# EAGLE design BLEbee-2_0_0-REV-A (EAGLE 6.4)
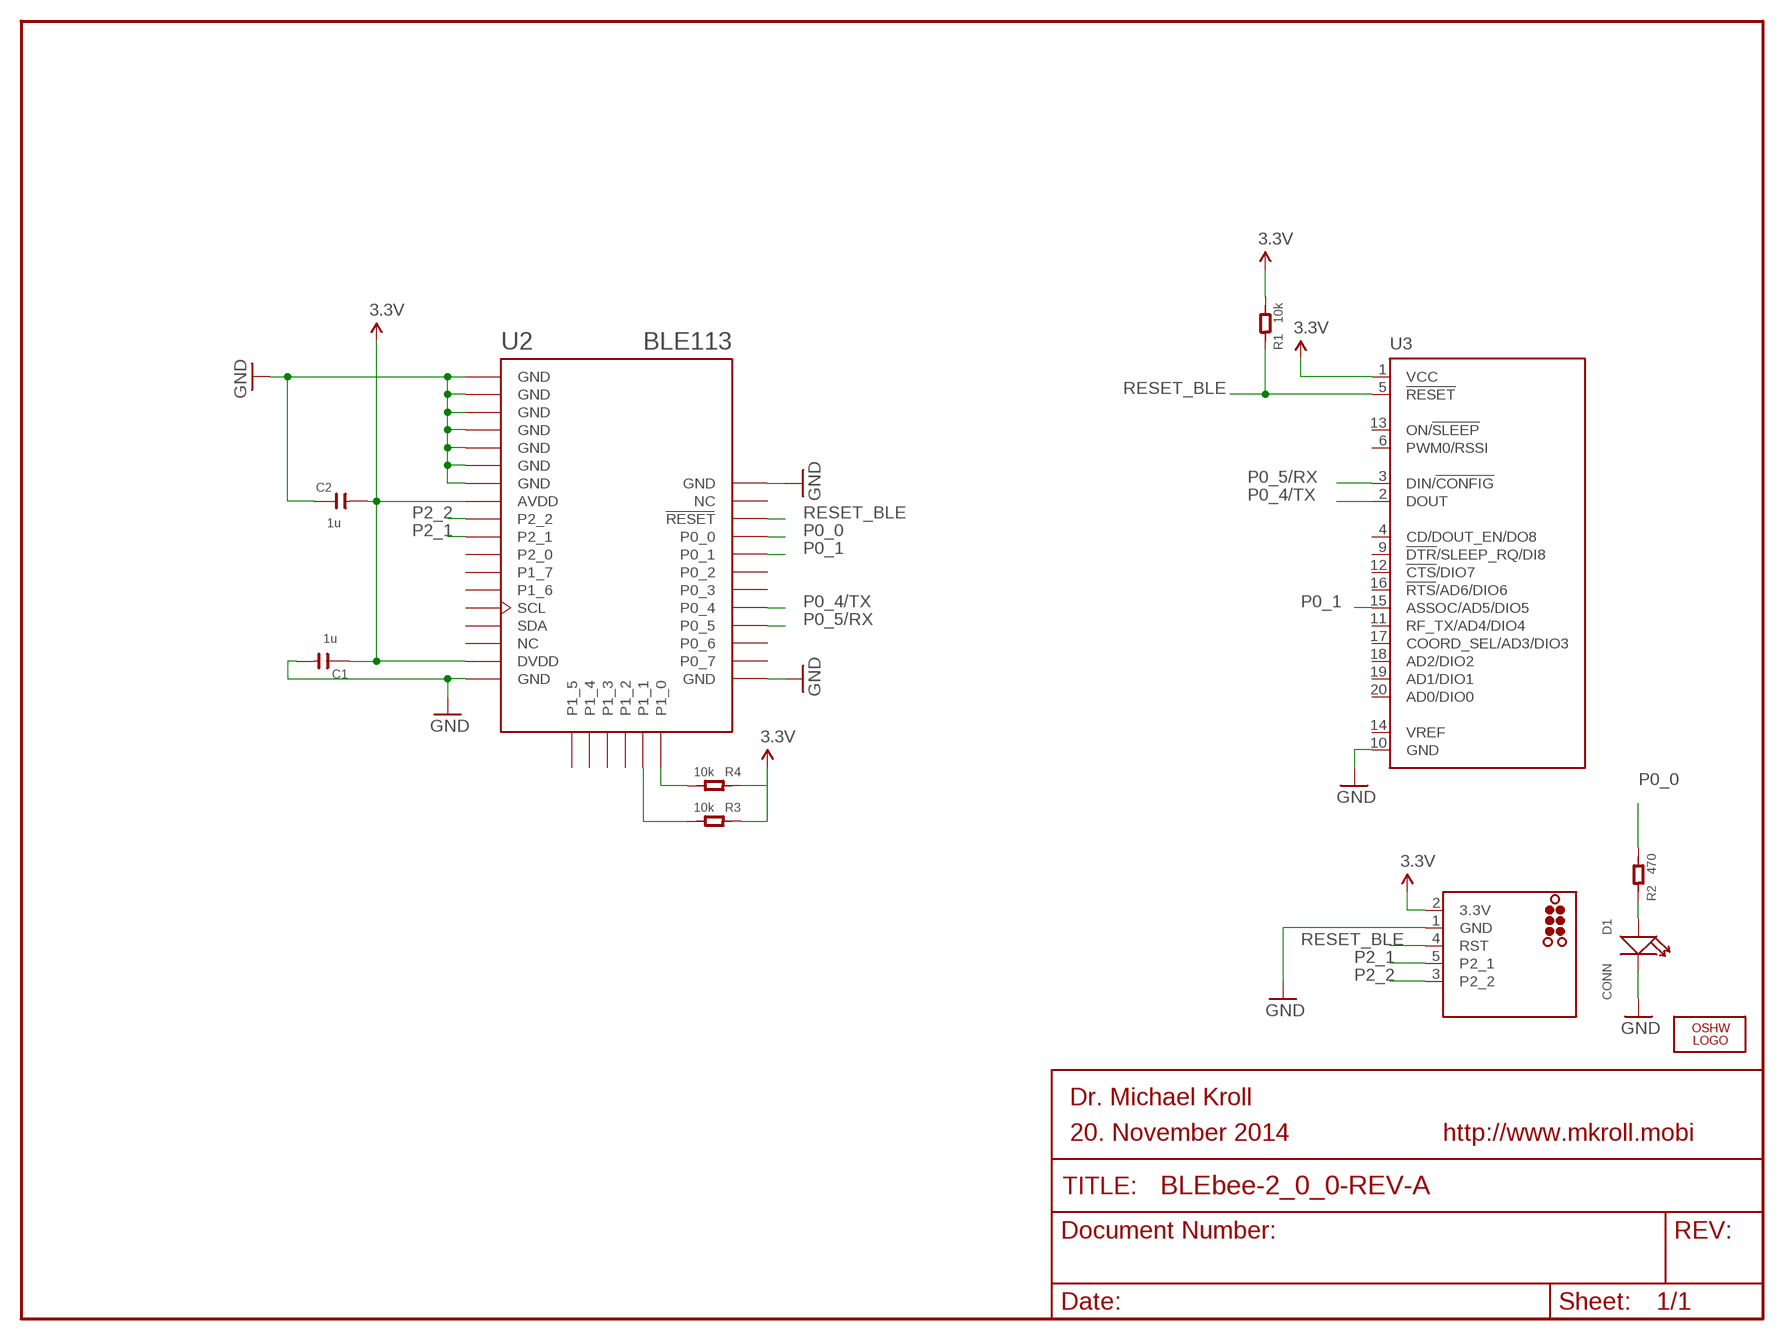
[diagram p0: schematic, sheet 1]

## Parts
C1  1u  C-0603  [C0603]
C2  1u  C-0603  [C0603]
D1  CONN  LED  [LED0603]
J1  TC2030-CC-DEBUGGER  [TC2030-MCP-NL]
LOGO1  LOGO-OSHW-6MILX0100-NT  [OSHW_6X100_NOTEXT]
R1  10k  R-0603  [R0603]
R2  470  R-0603  [R0603]
R3  10k  R-0603  [R0603]
R4  10k  R-0603  [R0603]
U2  BLE113  BLE113-A-VISUAL  [BLE113-A]
U3  MODULE_BEE-XBEE-DIP  [MODULE_20P-DIP-2.0-W/-SILK]

## Nets
3.3V: C1.2 C2.1 J1.2(3.3V) R1.2 R3.1 R4.1 U2.AVDD U2.DVDD U3.1(VCC)
GND: C1.1 C2.2 D1.- J1.1(GND) U2.GND U2.GND@2(GND) U2.GND@3(GND) U2.GND@4(GND) U2.GND@5(GND) U2.GND@6(GND) U2.GND@7(GND) U2.GND@8(GND) U2.GND@9(GND) U2.GND@10(GND) U3.10(GND)
N$1: D1.+ R2.1
N$12: R4.2 U2.P1_0
N$13: R3.2 U2.P1_1
P0_0: R2.2 U2.P0_0
P0_1: U2.P0_1 U3.15(ASSOC/AD5/DIO5)
P0_4/TX: U2.P0_4 U3.2(DOUT)
P0_5/RX: U2.P0_5 U3.3(DIN/!CONFIG)
P2_1: J1.5(P2_1) U2.P2_1
P2_2: J1.3(P2_2) U2.P2_2
RESET_BLE: J1.4(RST) R1.1 U2.RESET U3.5(!RESET)
Unconnected: U2.NC U2.NC@2(NC) U2.P0_2 U2.P0_3 U2.P0_6 U2.P0_7 U2.P1_2 U2.P1_3 U2.P1_4 U2.P1_5 U2.P1_6 U2.P1_7 U2.P2_0 U2.SCL U2.SDA U3.4(CD/DOUT_EN/DO8) U3.6(PWM0/RSSI) U3.9(!DTR!/SLEEP_RQ/DI8) U3.11(RF_TX/AD4/DIO4) U3.12(!CTS!/DIO7) U3.13(ON/!SLEEP) U3.14(VREF) U3.16(!RTS!/AD6/DIO6) U3.17(COORD_SEL/AD3/DIO3) U3.18(AD2/DIO2) U3.19(AD1/DIO1) U3.20(AD0/DIO0)

## Notes on the sheet
- Dr. Michael Kroll
- 20. November 2014 | http://www.mkroll.mobi

## Library data of the parts
C1 C2 = OPL:C*
D1 = OPL:LED*: LED
J1 = Tag-Connect:TC2030-CC-DEBUGGER: Arduino TAG-CONNECT ICSP Connector Manufacturer: Tag-Connect <http://www.tag-connect.com> Cable for easy Arduino In-Circuit Bootloader and Sketch Programming. PAD Description 1 MISO 2 VCC 3 SCK 4 MOSI 5 RST 6 GND ©2013 http://www.mkroll.mobi - modified and updated by Dr. Michael Kroll ‹dr.michael.kroll@gmail.com›
LOGO1 = Logo:LOGO-OSHW-6MIL
R1-R4 = OPL:R*
U2 = sf-bluegiga:BLE113-A-VISUAL: Bluetooth Low Energy single-mode module - Bluetooth 4.0, chip antenna (CC2541)
U3 = BLEbee-1_0_0-REV-B:MODULE_BEE-XBEE: XBee (TM) /XBee-PRO(TM) OEM RF Modules Source: MaxStream, Inc. xbee_productmanual.pdf

## Board
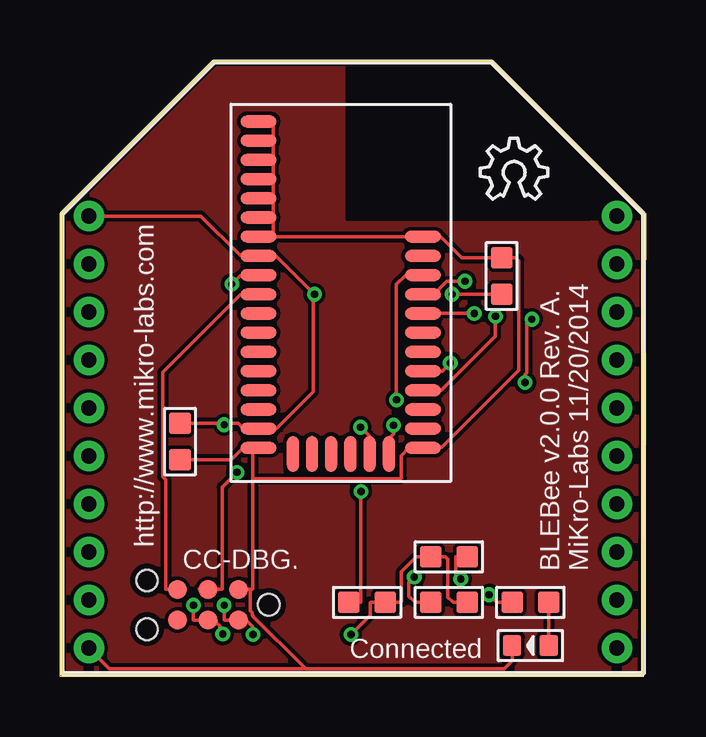
[diagram p1: board, top side]
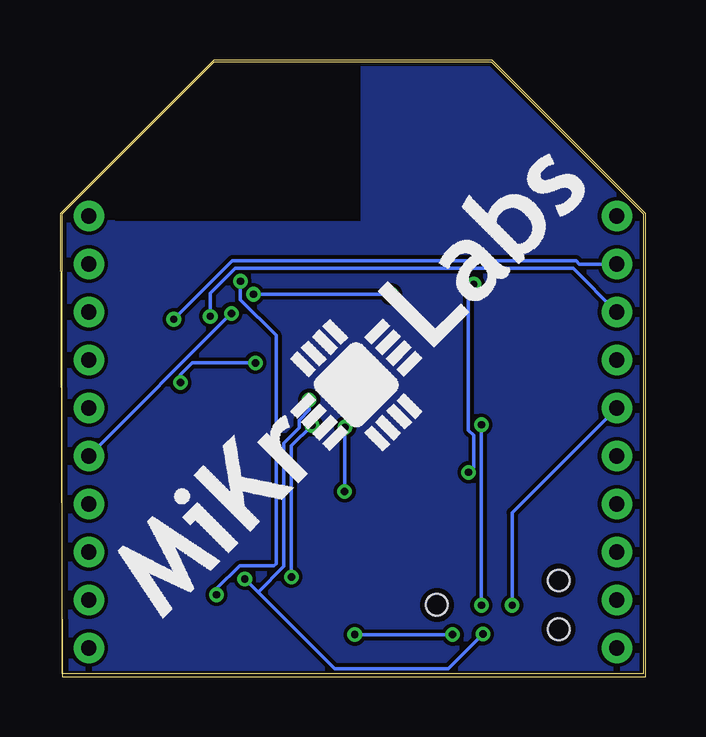
[diagram p2: board, bottom side, seen from below]

Size 24.4 x 25.7 mm. Coordinates in mm from the lower left corner, seen from the top.
Outline: 0,19.3 6.4,25.7 18,25.7 24.4,19.3 24.3,0 0,0 0,19.3
Copper layers (1*2*15*16): Top 0.035mm / dielectric 0.2mm / layer 2 0.0175mm / dielectric 1.1mm / layer 15 0.0175mm / dielectric 0.2mm / Bottom 0.035mm
Design rules "SeeedStudio_DRU_no_angle_20130527": minimum track width 6mil, minimum drill 12mil, track to track 6mil, track to pad 6mil, pad to pad 6mil, via to via 6mil, smd to smd 0mil, copper to edge 10mil, drill to drill 10mil, minimum pad ring 6mil, minimum via ring 6mil, stop-mask expansion 2mil, vias tented up to drill 25mil, thermal gap 10mil
tRestrict: area 11.9,19 to 22.1,25.9
bRestrict: area 11.9,19 to 22.1,25.9

### Footprints (pad centres in the part's own frame; a part is rotated, then mirrored left to right if it is on the bottom)
C0603 = smd 0.889 x 0.889: 1 -0.762,0; 2 0.762,0
LED0603 = smd 0.762 x 0.889: + -0.762,0; - 0.762,0
TC2030-MCP-NL = smd 0.787 x 0.787: 1 1.27,-0.635; 2 1.27,0.635; 3 2.54,-0.635; 4 2.54,0.635; 5 3.81,-0.635; 6 3.81,0.635 | hole 0.889: 0,0; 5.08,-1.016; 5.08,1.016
R0603 = smd 0.889 x 0.889: 1 -0.762,0; 2 0.762,0
BLE113-A = smd 1.5 x 0.5: AVDD -3.425,1.538; DVDD -3.425,-5.662; GND -3.425,7.138; GND@2 -3.425,6.338; GND@3 -3.425,5.537; GND@4 -3.425,4.737; GND@5 -3.425,3.938; GND@6 -3.425,3.138; GND@7 -3.425,2.337; GND@8 -3.425,-6.463; GND@9 3.425,-6.463; GND@10 3.425,2.337; NC -3.425,-4.862; NC@2 3.425,1.538; P0_0 3.425,-0.062; P0_1 3.425,-0.863; P0_2 3.425,-1.663; P0_3 3.425,-2.462; P0_4 3.425,-3.263; P0_5 3.425,-4.062; P0_6 3.425,-4.862; P0_7 3.425,-5.662; P1_6 -3.425,-2.462; P1_7 -3.425,-1.663; P2_0 -3.425,-0.863; P2_1 -3.425,-0.062; P2_2 -3.425,0.738; RESET 3.425,0.738; SCL -3.425,-3.263; SDA -3.425,-4.062 | smd 0.5 x 1.5: P1_0 2,-6.713; P1_1 1.2,-6.713; P1_2 0.4,-6.713; P1_3 -0.4,-6.713; P1_4 -1.2,-6.713; P1_5 -2,-6.713
MODULE_20P-DIP-2.0-W/-SILK = drill 0.635 pad 1.27: 1 -11,9; 2 -11,7; 3 -11,5; 4 -11,3; 5 -11,1; 6 -11,-1; 7 -11,-3; 8 -11,-5; 9 -11,-7; 10 -11,-9; 11 11,-9; 12 11,-7; 13 11,-5; 14 11,-3; 15 11,-1; 16 11,1; 17 11,3; 18 11,5; 19 11,7; 20 11,9

### Placement (x,y rotation side)
C1  5,9.8 90 top
C2  18.4,16.7 90 top
D1  19.6,1.3 180 top
J1  8.7,3 180 top
LOGO1  17.5,19.9 0 top
R1  16.2,5 180 top
R2  19.6,3.1 180 top
R3  12.8,3.1 180 top
R4  16.2,3.1 180 top
U2  11.7,16 0 top
U3  12.2,10.2 0 top
U$1  [MIKROLABS-LOGO]  18.8,0.7 45 bottom

### Tracks (layer width: path | path; a pad name or v marks a point on that pad's centre or on a via)
3.3V  (via drill 0.3)
  Top 0.152: R4.1 16.38,3.1 16.16,3.32 16.16,4.9 16.06,5 R1.2 14.84,5 14.22,4.38 14.22,3.12 14.2,3.1 R3.1 12.94,3.1 12.92,3.08 12.92,2.56 v12.12,1.76 | v8.04,1.76 8.04,2.08 7.76,2.36 J1.2 7.36,2.36 6.86,2.36 6.84,2.38 v6.84,2.98 | 6.84,10.56 7.42,10.56 7.64,10.34 8.26,10.34 U2.DVDD 8.34,10.34 9.02,10.34 10.56,11.88 10.56,15.88 v10.6,15.94 9.02,17.52 8.92,17.52 8.9,17.54 U2.AVDD 8.2,17.54 7.64,17.54 7.62,17.56 7.5,17.56 5.86,19.2 U3.1 | 6.84,10.56 5.02,10.56 4.96,10.5 4.68,10.5 4.64,10.54 4.64,10.56 C1.2 | v16.34,15.94 C2.1 | v6.84,10.5 6.84,10.56
  Bottom 0.152: v12.12,1.76 v8.04,1.76 | v10.6,15.94 v16.34,15.94 | v6.84,10.5 v6.84,2.98
GND
  Top 0.152: U2.GND 8.86,23.14 8.88,23.12 8.88,22.4 U2.GND@2 8.86,22.34 8.88,22.32 8.88,21.6 U2.GND@3 8.86,21.54 8.88,21.52 8.88,20.8 U2.GND@4 8.86,20.74 8.88,20.72 8.88,20 U2.GND@5 8.86,19.94 8.88,19.92 8.88,19.2 U2.GND@6 8.86,19.14 8.88,19.12 8.88,18.36 8.86,18.34 U2.GND@7 8.94,18.34 15.06,18.34 U2.GND@10 15.76,18.34 15.78,18.32 15.88,18.32 16.74,17.46 C2.2 18.46,17.46 19,17.46 19.12,17.34 19.12,12.78 15.9,9.56 15.78,9.56 15.76,9.54 15.2,9.54 U2.GND@9 14.54,9.54 14.22,9.22 14.22,8.28 14.2,8.26 8.04,8.26 | 7.92,3.64 8.02,3.64 8.04,3.66 8.04,8.26 | 7.92,3.64 J1.1 | 8.04,8.26 8.04,9.54 8.26,9.54 U2.GND@8 7.98,9.54 7.64,9.54 7.14,9.04 5.02,9.04 4.96,9.1 4.68,9.1 4.64,9.06 4.64,9.04 C1.1 | 10.17,0.39 8.04,2.52 8.04,2.56 8.02,2.58 8.02,2.6 8,2.62 8,2.66 7.98,2.68 7.98,2.7 7.92,2.76 7.92,3.64 | 10.17,0.39 10.22,0.34 18.52,0.34 18.84,0.66 18.84,1.28 18.9,1.34 18.9,1.62 18.86,1.66 18.84,1.66 D1.- | U3.10 2.06,0.34 10.12,0.34 10.17,0.39
N$1
  Top 0.152: D1.+ 20.36,3.08 20.34,3.1 20.02,3.1 20.02,3.12 20.06,3.16 20.3,3.16 R2.1
N$2
  pour Top: 0.1,19.3 6.4,25.6 11.8,25.6 11.8,18.9 24.3,18.9 24.3,0.1 0.1,0.1
N$3
  pour Bottom: 0.1,19.3 6.4,25.6 11.8,25.6 11.8,18.9 24.3,18.9 24.3,0.2 0.1,0.2
N$12  (via drill 0.3)
  Top 0.152: R4.2 14.8,3.1 14.54,3.36 14.54,3.94 v14.76,4.16 | v13.9,10.48 13.9,10.12 13.7,9.92 U2.P1_0
  Bottom 0.152: v14.76,4.16 14.76,9.62 v13.9,10.48
N$13  (via drill 0.3)
  Top 0.152: R3.2 12.54,3.1 v12.54,7.72 | v12.52,10.4 12.88,10.04 12.88,9.94 12.9,9.92 U2.P1_1
  Bottom 0.152: v12.54,7.72 12.54,10.38 v12.52,10.4
P0_0  (via drill 0.3)
  Top 0.152: R2.2 18.2,3.1 v17.88,3.42 | v16.88,16.48 16.12,16.48 15.78,16.14 15.78,15.96 15.76,15.94 U2.P0_0
  Bottom 0.152: v17.88,3.42 17.88,3.66 16.92,4.62 15.5,4.62 15.4,4.72 15.4,14.24 16.88,15.72 v16.88,16.48
P0_1  (via drill 0.3)
  Top 0.152: v17.26,15.14 U2.P0_1
  Bottom 0.152: U3.15 v17.26,15.14
P0_4/TX  (via drill 0.3)
  Top 0.152: v16.26,13.08 15.92,12.74 U2.P0_4 | v19.38,12.26 19.38,12.6 19.44,12.66 19.44,14.68 v19.66,14.9
  Bottom 0.152: v16.26,13.08 18.88,13.08 19.38,12.58 v19.38,12.26 | v19.66,14.9 17.22,17.34 2.9,17.34 2.76,17.2 U3.2
P0_5/RX  (via drill 0.3)
  Top 0.152: v18.14,15.02 18.14,14.2 15.88,11.94 U2.P0_5
  Bottom 0.152: v18.14,15.02 18.14,15.98 17.1,17.02 3.02,17.02 U3.3
P2_1
  Top 0.152: J1.5 4.4,3.64 4.4,8.22 4.28,8.34 4.28,12.68 7.52,15.92 7.62,15.92 7.64,15.94 8.26,15.94 U2.P2_1
P2_2  (via drill 0.3)
  Top 0.152: v7.38,8.52 6.76,7.9 6.76,3.66 6.74,3.64 6.18,3.64 6.12,3.7 5.84,3.7 5.8,3.66 5.8,3.64 J1.3 | v7.16,16.36 7.52,16.72 7.62,16.72 7.64,16.74 8.26,16.74 U2.P2_2
  Bottom 0.152: v7.38,8.52 7.16,8.74 7.16,10.06 7.38,10.28 7.38,16.14 v7.16,16.36
RESET_BLE  (via drill 0.3)
  Top 0.152: v5.56,2.98 5.56,2.38 5.58,2.36 J1.4 6.22,2.36 6.52,2.36 6.52,2.26 6.66,2.12 6.66,1.9 v6.78,1.78 | R1.1 16.48,5 16.48,4.3 v16.7,4.08 | v14.02,11.54 14.02,16.36 14.4,16.74 U2.RESET
  Bottom 0.152: v5.56,2.98 5.56,6.84 U3.5 | 16.15,3.53 12.96,0.34 8.22,0.34 v6.78,1.78 | 16.15,3.53 v16.7,4.08 | v14.02,11.54 14.02,11.12 14.44,10.7 14.44,10.38 15.08,9.74 15.08,4.6 16.15,3.53

### Text on the board
tNames: http://www.mikro-labs.com | CC-DBG. | BLEBee v2.0.0 Rev. A. | MiKro-Labs 11/20/2014 | Connected